# EasyEDA Pro project ProProject_Board4_2024-06-03.epro

# Schematic Schematic4
Create Date: 2024-05-31; Page Name: P1; Project Name: 咸鱼1; Schematic Name: Schematic4; Update Date: 2024-05-31; Company: 嘉立创EDA; Page Size: A4; Version: V1.0
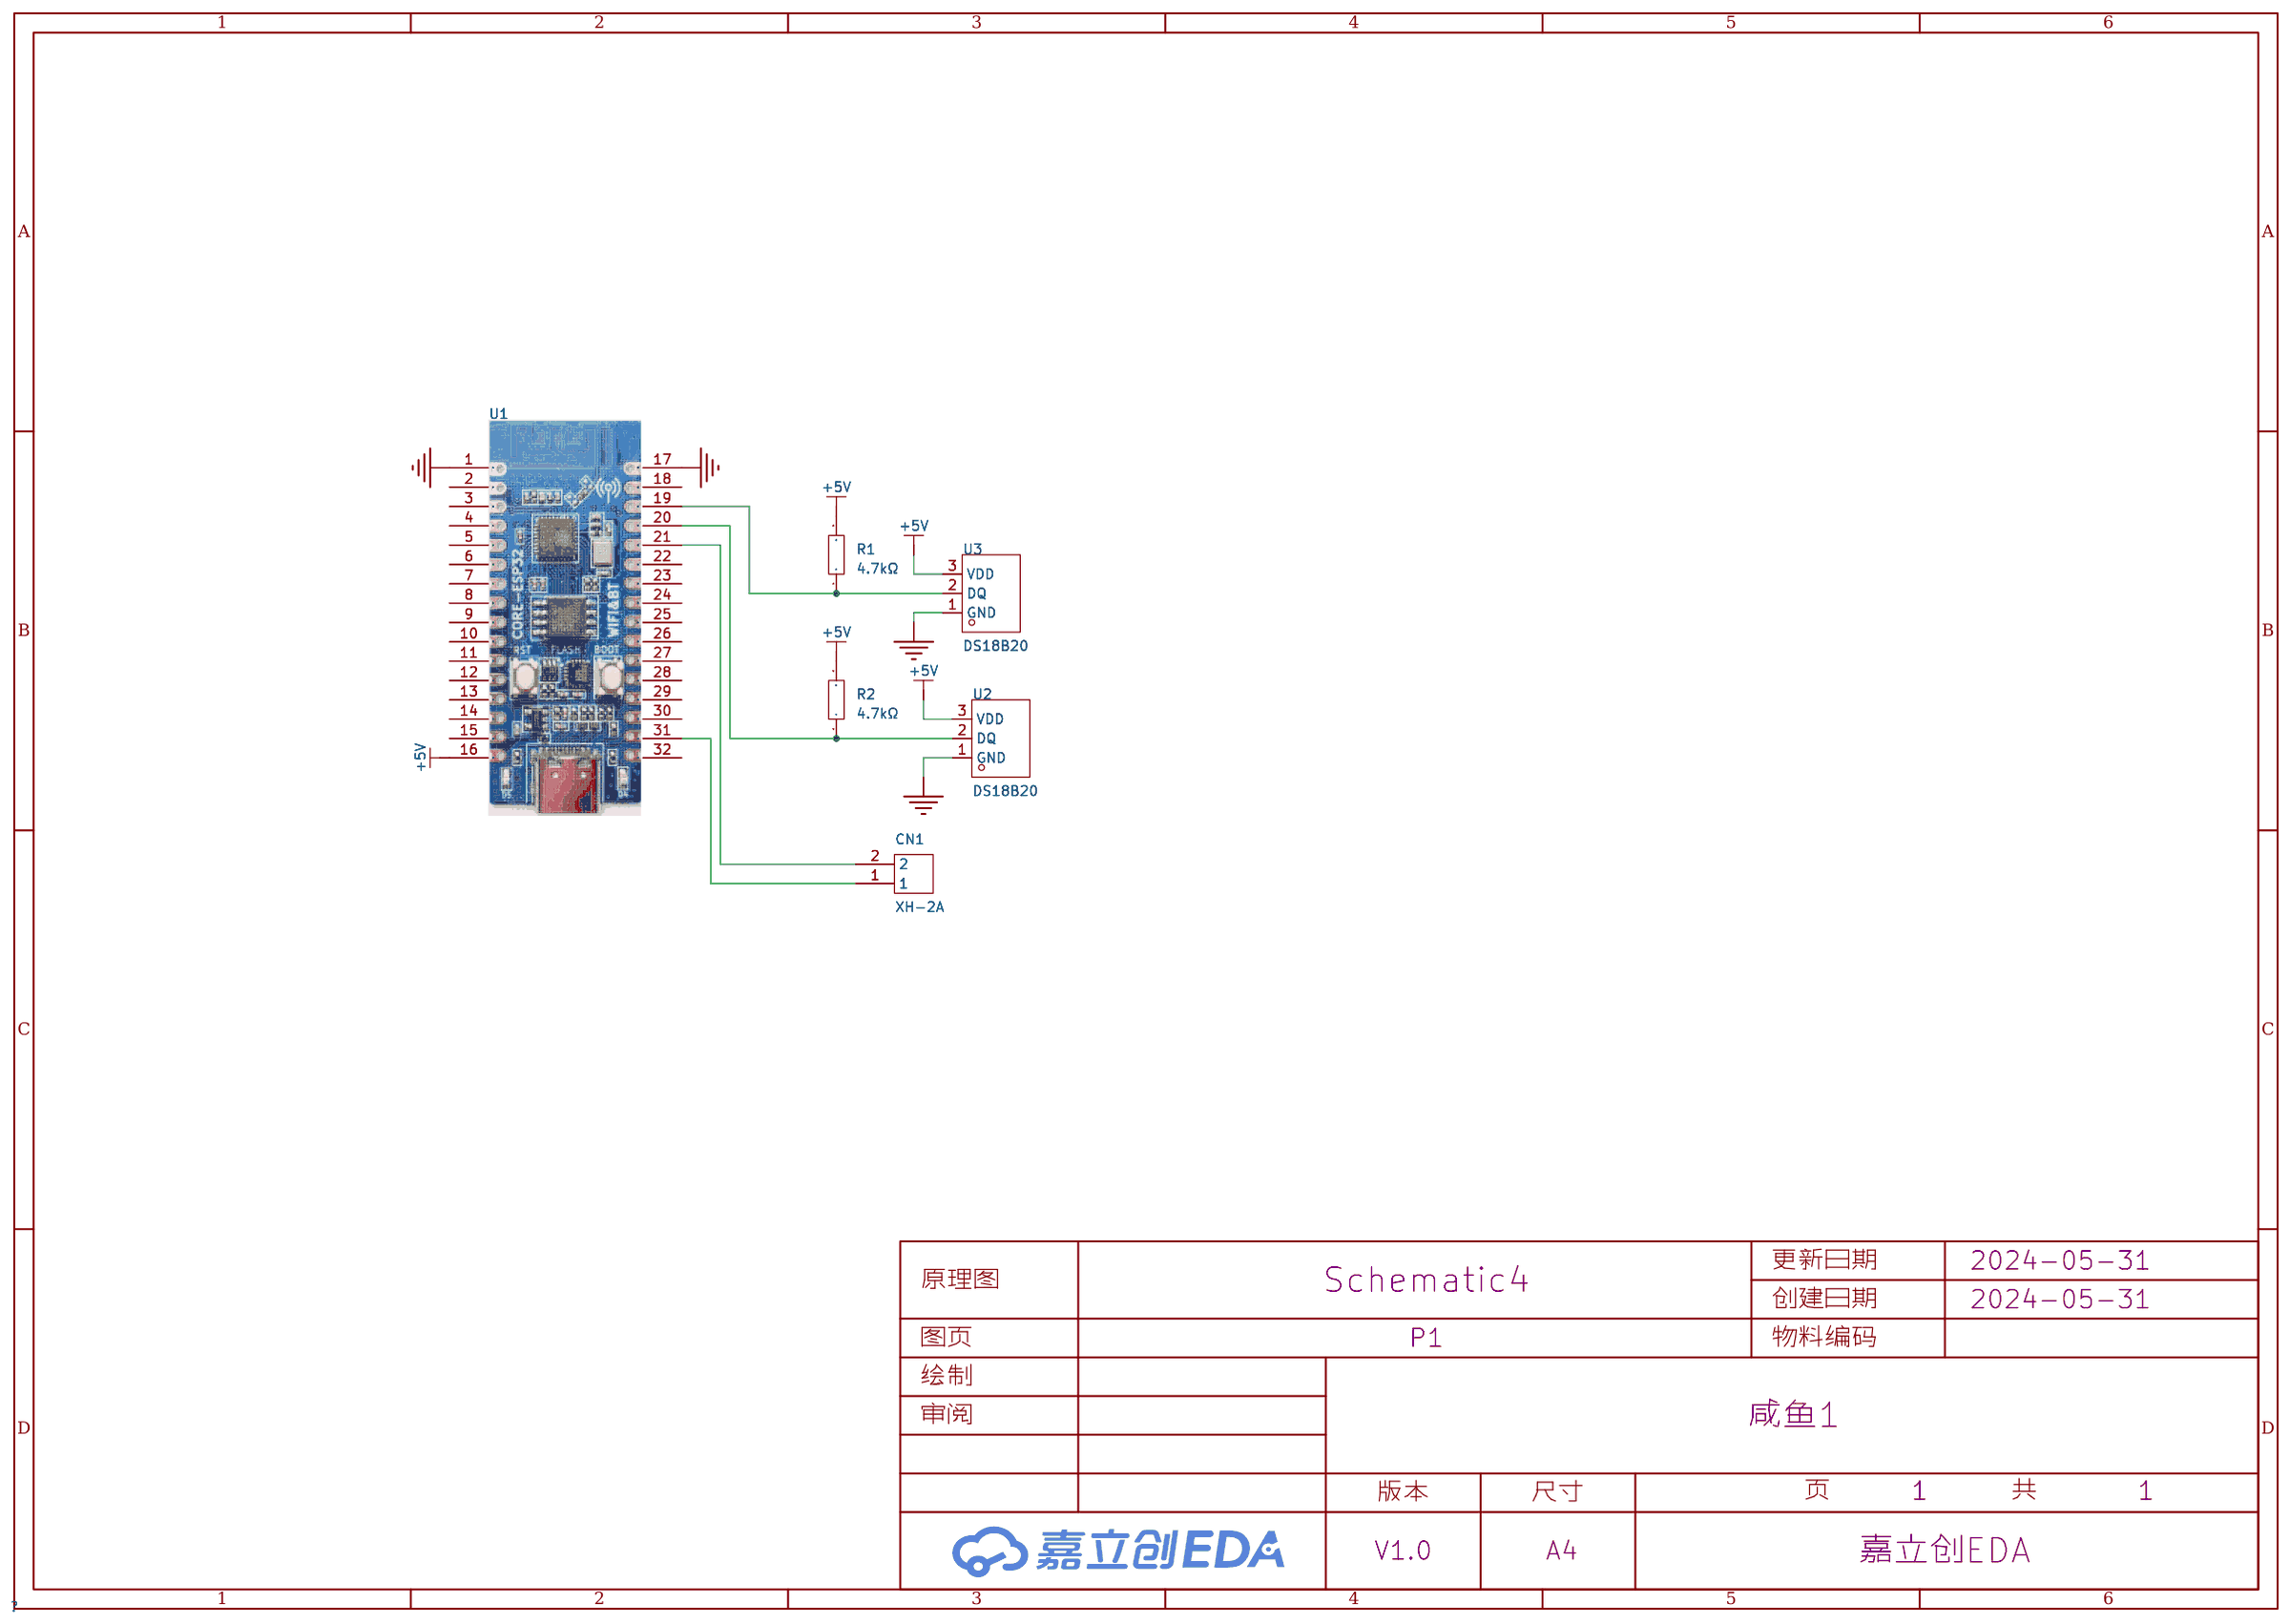
[diagram p0: schematic sheet]

## Parts
CN1  XH-2A  [CONN-TH_XH-2A]
R1  4.7kΩ  [R0805]
R2  4.7kΩ  [R0805]
U1  -  [ESP32C3-CORE开发板]
U2  DS18B20  [TO-92-3_L4.9-W3.7-P1.27-L]
U3  DS18B20  [TO-92-3_L4.9-W3.7-P1.27-L]

## Library data of the parts
CN1 = XH-2A_C20079: 插针结构:1x2P;间距:2.5mm;安装方式:-;参考系列:XH;总PIN数:2P;排数:1;每排PIN数:2;行距:-;触头材质:-;; LCSC Part Name: 系列:XH 间距:2.5mm 1x2P; Supplier Part: C20079; Manufacturer: BOOMELE(博穆精密); Supplier Footprint: 插件,P=2.5mm; JLCPCB Part Class: 扩展库; Datasheet: https://atta.szlcsc.com/upload/public/pdf/source/20151225/1457707654857.pdf; Supplier: LCSC; Pins Structure: 1x2P; Pitch: 2.5mm; Reference Series: XH; Number of Pins: 2P; Number of Rows: 1; Number of PINs Per Row: 2
R1 R2 = 0805W8F4701T5E: 电阻类型:厚膜电阻;阻值:4.7kΩ;精度:±1%;功率:125mW;最大工作电压:150V;温度系数:±100ppm/℃;; LCSC Part Name: 4.7kΩ ±1% 125mW 厚膜电阻; Supplier Part: C17673; Manufacturer: UNI-ROYAL(厚声); Supplier Footprint: 0805; JLCPCB Part Class: 基础库; Datasheet: https://atta.szlcsc.com/upload/public/pdf/source/20200306/C422600_1E6D84923E4A46A82E41ADD87F860B5C.pdf; Supplier: LCSC; Type: 厚膜电阻; Tolerance: ±1%; Power(Watts): 125mW; Overload Voltage (Max): 150V; Temperature Coefficient: ±100ppm/℃; Operating Temperature Range: -55℃~+155℃
U1 = ESP32C3-CORE开发板
U2 U3 = DS18B20: 温度范围:-55℃~+125℃;精度:±0.4℃;接口类型:-;; Supplier Part: C376006; Manufacturer: UMW(友台半导体); Supplier Footprint: TO-92; JLCPCB Part Class: 扩展库; Datasheet: https://atta.szlcsc.com/upload/public/pdf/source/20231109/DC3DA9D47D486EF40A6E0F08B9A498E3.pdf; Supplier: LCSC; Temperature range: -55℃~+125℃; Resolution: ±0.4℃; Supply Voltage: 3V~5.5V

## Nets
+5V: R1.2 R2.2 U1.16 U2.3(VDD) U3.3(VDD)
GND: U1.1 U1.17 U2.1(GND) U3.1(GND)
Net-(CN1-1): CN1.1 U1.31
Net-(CN1-2): CN1.2 U1.21
Net-(R1-1): R1.1 U1.19 U3.2(DQ)
Net-(R2-1): R2.1 U1.20 U2.2(DQ)

Not connected (* = marked no-connect by the designer): U1 2 3 4 5 6 7 8 9 10 11 12 13 14 15 18 22 23 24 25 26 27 28 29 30 32

# Board PCB35
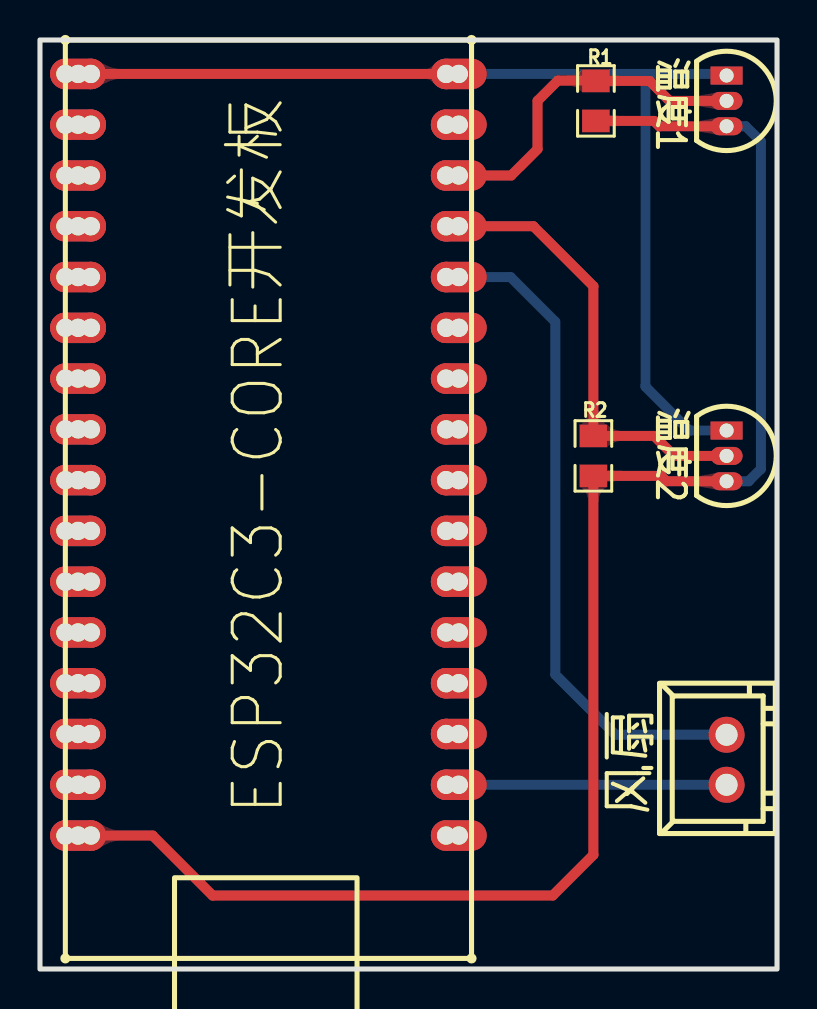
[diagram p1: board, top side]
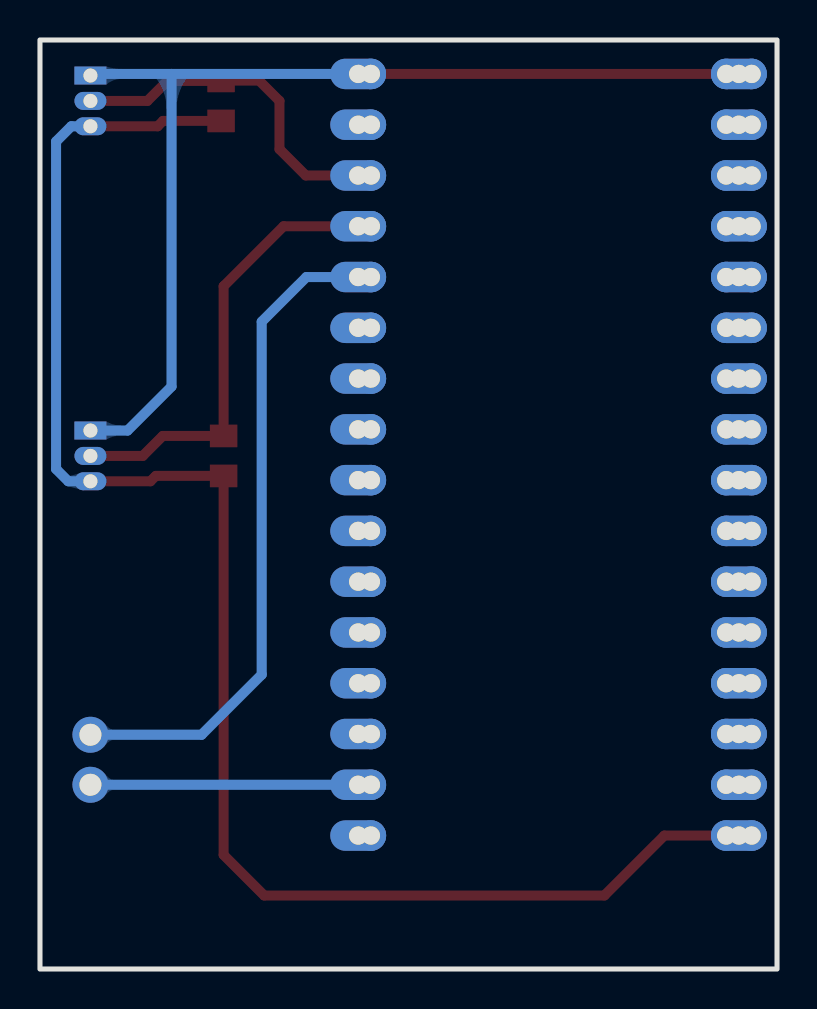
[diagram p2: board, bottom side, seen from below]

Outline 36.87 x 46.48 mm; copper layers: Top Layer, Bottom Layer. Coordinates in mm from the lower left corner of the outline.
Outline path: rectangle 0,46.48 36.87,0
Stack: Top Layer 0.035mm / Dielectric1 1.51mm FR4 er 4.5 / Bottom Layer 0.035mm

## Design rules (mm)
template: JLCPCB Capability(Two Layers Board)
spacing copperThickness1oz (default): track to track 0.102, other pairs 0.152 to 0.3
spacing copperThickness2oz: track to track 0.203, other pairs 0.152 to 0.3
track width copperThickness1oz (default): min 0.127, default 0.254, max 2.54
track width copperThickness2oz: min 0.203, default 0.254, max 2.54
differential pair differentialPair (default): width min 0.127, default 0.254, max 2.54; gap min 0.152, default 0.152
via viaSize (default): diameter min 0.5, default 0.61, max 10; hole min 0.3, default 0.305, max 6.3

## Placement (name value [footprint] x y rotation side)
CN1  XH-2A  [CONN-TH_XH-2A]  34.35 10.47 90 top
ESP32C3-CORE开发板  -  [ESP32C3-CORE开发板]  -3.17 -2.67 0 top
R1  4.7kΩ  [R0805]  27.81 43.43 270 top
R2  4.7kΩ  [R0805]  27.69 25.67 270 top
U2  DS18B20  [TO-92-3_L4.9-W3.7-P1.27-L]  34.35 25.67 270 top
U3  DS18B20  [TO-92-3_L4.9-W3.7-P1.27-L]  34.35 43.43 270 top

## Footprints (pads in the part's own frame, mm; a bottom-side part is the same pattern mirrored in y, then rotated)
CONN-TH_XH-2A
  round 1.8 hole 1.1: 1(-1.251,0) 2(1.251,0)
ESP32C3-CORE开发板
  round 1.524 hole 0.914: 1(4.447,47.45) 1(5.717,47.45) 2(4.447,44.91) 2(5.717,44.91) 3(4.447,42.37) 3(5.717,42.37) 4(4.447,39.83) 4(5.717,39.83) 5(4.447,37.29) 5(5.717,37.29) 6(4.447,34.75) 6(5.717,34.75) 7(4.447,32.21) 7(5.717,32.21) 8(4.447,29.67) 8(5.717,29.67) 9(4.447,27.13) 9(5.717,27.13) 10(4.447,24.59) 10(5.717,24.59) 11(4.447,22.05) 11(5.717,22.05) 12(4.447,19.51) 12(5.717,19.51) 13(4.447,16.97) 13(5.717,16.97) 14(4.447,14.43) 14(5.717,14.43) 15(4.447,11.89) 15(5.717,11.89) 16(4.447,9.35) 16(5.717,9.35) 17(23.494,47.45) 18(23.494,44.91) 19(23.494,42.37) 20(23.494,39.83) 21(23.494,37.29) 22(23.494,34.75) 23(23.494,32.21) 24(23.494,29.67) 25(23.494,27.13) 26(23.494,24.59) 27(23.494,22.05) 28(23.494,19.51) 29(23.494,16.97) 30(23.494,14.43) 31(23.494,11.89) 32(23.494,9.35)
  oval 2.794x1.524 hole 0.914: 1(5.082,47.45) 2(5.082,44.91) 3(5.082,42.37) 4(5.082,39.83) 5(5.082,37.29) 6(5.082,34.75) 7(5.082,32.21) 8(5.082,29.67) 9(5.082,27.13) 10(5.082,24.59) 11(5.082,22.05) 12(5.082,19.51) 13(5.082,16.97) 14(5.082,14.43) 14(5.082,11.89) 16(5.082,9.35) 17(24.129,47.45) 18(24.129,44.91) 19(24.129,42.37) 20(24.129,39.83) 21(24.129,37.29) 22(24.129,34.75) 23(24.129,32.21) 24(24.129,29.67) 25(24.129,27.13) 26(24.129,24.59) 27(24.129,22.05) 28(24.129,19.51) 29(24.129,16.97) 30(24.129,14.43) 31(24.129,11.89) 32(24.129,9.35)
R0805
  rect 1.133x1.377 smd: 1(-1,0) 2(1,0)
TO-92-3_L4.9-W3.7-P1.27-L
  rect 0.9x1.6 hole 0.7: 1(-1.27,0)
  oval 0.9x1.6 hole 0.7: 2(0,0) 3(1.27,0)

## Nets
+5V: ESP32C3-CORE开发板.16 R1.2 R2.2 U2.3 U3.3
GND: ESP32C3-CORE开发板.1 ESP32C3-CORE开发板.17 U2.1 U3.1
$1N2972: ESP32C3-CORE开发板.19 R1.1 U3.2
$1N2983: ESP32C3-CORE开发板.20 R2.1 U2.2
$1N3086: CN1.2 ESP32C3-CORE开发板.21
$1N3174: CN1.1 ESP32C3-CORE开发板.31

Pads without a net: ESP32C3-CORE开发板 2 3 4 5 6 7 8 9 10 11 12 13 14 15 18 22 23 24 25 26 27 28 29 30 32

## Routing (per net, layer and track width the routed paths; a pad name or vN(x,y) marks a point on that pad's centre or on a via; arc(x,y) is an arc through that point)
+5V: length 80
  Top Layer w0.5: ESP32C3-CORE开发板.16 5.64,6.68 8.64,3.68 25.65,3.68 27.69,5.71 R2.2 31.08,24.67 31.35,24.4 U2.3 ; U3.3 30.99,42.16 30.72,42.43 R1.2
  Bottom Layer w0.5: U2.3 35.45,24.4 36.07,25.01 36.07,41.4 35.31,42.16 U3.3
GND: length 52.4
  Top Layer w0.5: ESP32C3-CORE开发板.1 ESP32C3-CORE开发板.17
  Bottom Layer w0.5: U3.1 34.27,44.78 30.29,44.78 ; 30.29,44.78 ESP32C3-CORE开发板.17 ; 30.29,44.78 30.29,29.14 32.49,26.94 U2.1
$1N2972: length 17.8
  Top Layer w0.5: U3.2 31.5,43.43 30.5,44.43 R1.1 27.8,44.44 25.91,44.44 24.89,43.43 24.89,41.02 23.57,39.7 ESP32C3-CORE开发板.19
$1N2983: length 22.5
  Top Layer w0.5: U2.2 31.73,25.67 30.73,26.67 R2.1 27.69,34.16 24.69,37.16 ESP32C3-CORE开发板.20
$1N3086: length 33.2
  Bottom Layer w0.5: CN1.2 28.79,11.72 25.78,14.73 25.78,32.38 23.54,34.62 ESP32C3-CORE开发板.21
$1N3174: length 14
  Bottom Layer w0.5: ESP32C3-CORE开发板.31 CN1.1

Small or netless copper shapes (teardrops, artwork), in the pictures only: 16 on Top Layer, 10 on Bottom Layer

## Text on the board
Top Silkscreen Layer: 温度1 | 温度2 | 风扇
